# EAGLE schematic PCB_2layers_editada_2607 (EAGLE 9.1.1)
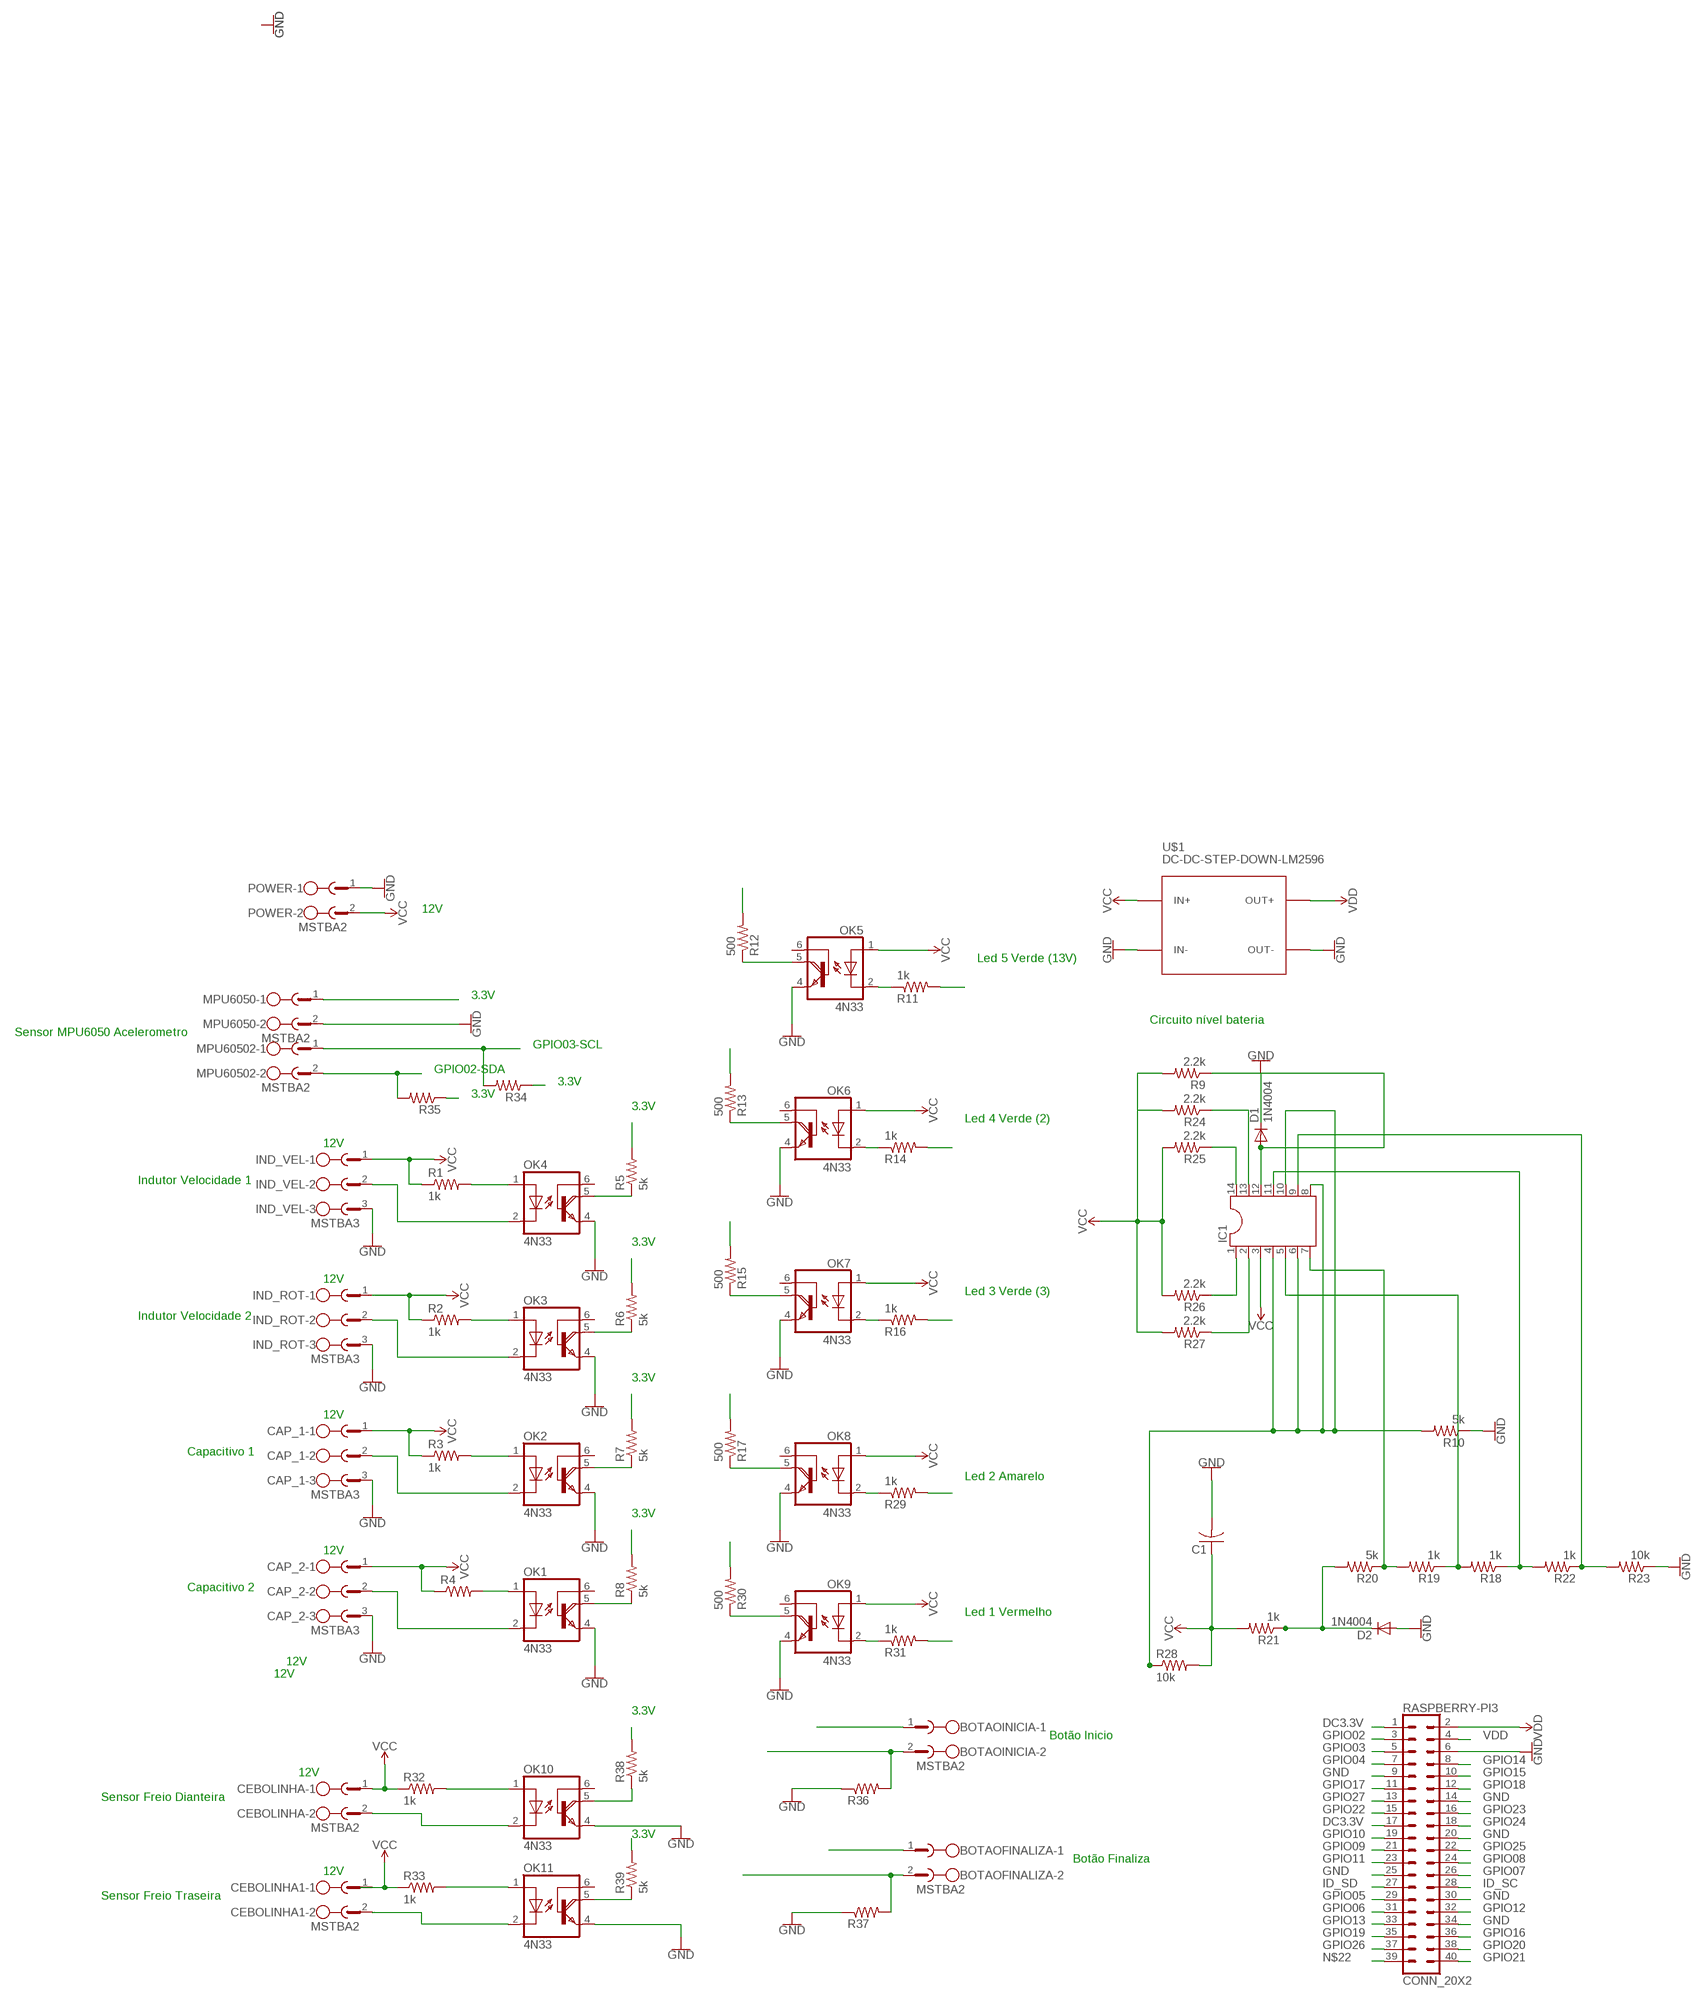
[diagram p0: schematic, sheet 1]

## Parts
BOTAOFINALIZA  MSTBA2  [MSTBA2]
BOTAOINICIA  MSTBA2  [MSTBA2]
C1  C-US025-050X050  [C025-050X050]
CAP_1  MSTBA3  [MSTBA3]
CAP_2  MSTBA3  [MSTBA3]
CEBOLINHA  MSTBA2  [MSTBA2]
CEBOLINHA1  MSTBA2  [MSTBA2]
D1  1N4004  [DO41-10]
D2  1N4004  [DO41-10]
IC1  DIL14  [DIL14]
IND_ROT  MSTBA3  [MSTBA3]
IND_VEL  MSTBA3  [MSTBA3]
MPU6050  MSTBA2  [MSTBA2]
MPU60502  MSTBA2  [MSTBA2]
OK1  4N33  [DIL06]
OK2  4N33  [DIL06]
OK3  4N33  [DIL06]
OK4  4N33  [DIL06]
OK5  4N33  [DIL06]
OK6  4N33  [DIL06]
OK7  4N33  [DIL06]
OK8  4N33  [DIL06]
OK9  4N33  [DIL06]
OK10  4N33  [DIL06]
OK11  4N33  [DIL06]
POWER  MSTBA2  [MSTBA2]
R1  1k  R-US_0204/7  [0204/7]
R2  1k  R-US_0204/7  [0204/7]
R3  1k  R-US_0204/7  [0204/7]
R4  R-US_0204/7  [0204/7]
R5  5k  R-US_0204/7  [0204/7]
R6  5k  R-US_0204/7  [0204/7]
R7  5k  R-US_0204/7  [0204/7]
R8  5k  R-US_0204/7  [0204/7]
R9  2.2k  R-US_0207/10  [0207/10]
R10  5k  R-US_0207/10  [0207/10]
R11  1k  R-US_0204/7  [0204/7]
R12  500  R-US_0204/7  [0204/7]
R13  500  R-US_0204/7  [0204/7]
R14  1k  R-US_0204/7  [0204/7]
R15  500  R-US_0204/7  [0204/7]
R16  1k  R-US_0204/7  [0204/7]
R17  500  R-US_0204/7  [0204/7]
R18  1k  R-US_0207/10  [0207/10]
R19  1k  R-US_0207/10  [0207/10]
R20  5k  R-US_0207/10  [0207/10]
R21  1k  R-US_0207/10  [0207/10]
R22  1k  R-US_0207/10  [0207/10]
R23  10k  R-US_0207/10  [0207/10]
R24  2.2k  R-US_0207/10  [0207/10]
R25  2.2k  R-US_0207/10  [0207/10]
R26  2.2k  R-US_0207/10  [0207/10]
R27  2.2k  R-US_0207/10  [0207/10]
R28  10k  R-US_0207/10  [0207/10]
R29  1k  R-US_0204/7  [0204/7]
R30  500  R-US_0204/7  [0204/7]
R31  1k  R-US_0204/7  [0204/7]
R32  1k  R-US_0204/7  [0204/7]
R33  1k  R-US_0204/7  [0204/7]
R34  R-US_0204/7  [0204/7]
R35  R-US_0204/7  [0204/7]
R36  R-US_0204/7  [0204/7]
R37  R-US_0204/7  [0204/7]
R38  5k  R-US_0204/7  [0204/7]
R39  5k  R-US_0204/7  [0204/7]
RASPBERRY-PI3  CONN_20X2  [2X20]
U$1  DC-DC-STEP-DOWN-LM2596  [DC-DC-STEP-DOWN-LM2596]

## Nets
DC3.3V: BOTAOFINALIZA.1 BOTAOINICIA.1 MPU6050.1 R5.2 R6.2 R7.2 R8.2 R12.2 R13.2 R15.2 R17.2 R30.2 R34.1 R35.1 R38.2 R39.2 RASPBERRY-PI3.1 RASPBERRY-PI3.17
GND: C1.2 CAP_1.3 CAP_2.3 D1.C D2.A IND_ROT.3 IND_VEL.3 MPU6050.2 OK1.4(E) OK2.4(E) OK3.4(E) OK4.4(E) OK5.4(E) OK6.4(E) OK7.4(E) OK8.4(E) OK9.4(E) OK10.4(E) OK11.4(E) POWER.1 R10.1 R23.1 R36.1 R37.1 RASPBERRY-PI3.6 RASPBERRY-PI3.9 RASPBERRY-PI3.14 RASPBERRY-PI3.20 RASPBERRY-PI3.25 RASPBERRY-PI3.30 RASPBERRY-PI3.34 U$1.IN- U$1.OUT-
GPIO01: CEBOLINHA1.2 OK11.2(C)
GPIO02: MPU60502.2 R35.2 RASPBERRY-PI3.3
GPIO03: MPU60502.1 R34.2 RASPBERRY-PI3.5
GPIO04: OK4.5(COL) R5.1 RASPBERRY-PI3.7
GPIO05: RASPBERRY-PI3.29
GPIO06: RASPBERRY-PI3.31
GPIO07: RASPBERRY-PI3.26
GPIO08: RASPBERRY-PI3.24
GPIO09: RASPBERRY-PI3.21
GPIO10: OK1.5(COL) R8.1 RASPBERRY-PI3.19
GPIO11: CEBOLINHA.2 OK10.2(C) RASPBERRY-PI3.23
GPIO12: RASPBERRY-PI3.32
GPIO13: RASPBERRY-PI3.33
GPIO14: OK5.5(COL) R12.1 RASPBERRY-PI3.8
GPIO15: OK6.5(COL) R13.1 RASPBERRY-PI3.10
GPIO16: BOTAOINICIA.2 R36.2 RASPBERRY-PI3.36
GPIO17: OK3.5(COL) R6.1 RASPBERRY-PI3.11
GPIO18: OK7.5(COL) R15.1 RASPBERRY-PI3.12
GPIO19: OK10.5(COL) R38.1 RASPBERRY-PI3.35
GPIO20: BOTAOFINALIZA.2 R37.2 RASPBERRY-PI3.38
GPIO21: RASPBERRY-PI3.40
GPIO22: OK2.5(COL) R7.1 RASPBERRY-PI3.15
GPIO23: OK8.5(COL) R17.1 RASPBERRY-PI3.16
GPIO24: OK9.5(COL) R30.1 RASPBERRY-PI3.18
GPIO25: RASPBERRY-PI3.22
GPIO26: OK11.5(COL) R39.1 RASPBERRY-PI3.37
GPIO27: RASPBERRY-PI3.13
ID_SC: RASPBERRY-PI3.28
ID_SD: RASPBERRY-PI3.27
LM339P1: IC1.1 R11.2 R26.1
LM339P2: IC1.2 R14.2 R27.1
LM339P12: R31.2
LM339P13: IC1.13 R16.2 R24.1
LM339P14: IC1.14 R25.1 R29.2
LM33912: D1.A IC1.12 R9.1
N$1: IND_ROT.2 OK3.2(C)
N$2: CAP_2.2 OK1.2(C)
N$3: CAP_1.2 OK2.2(C)
N$4: OK3.1(A) R2.2
N$5: OK2.1(A) R3.2
N$6: OK1.1(A) R4.2
N$7: OK4.1(A) R1.2
N$8: IND_VEL.2 OK4.2(C)
N$13: D2.C R20.2 R21.1
N$14: IC1.9 R22.1 R23.2
N$15: IC1.4 IC1.6 IC1.8 IC1.10 R10.2 R28.1
N$16: IC1.5 R18.2 R19.1
N$17: IC1.11 R18.1 R22.2
N$18: IC1.7 R19.2 R20.1
N$22: RASPBERRY-PI3.39
N$24: OK5.2(C) R11.1
N$27: OK6.2(C) R14.1
N$28: OK10.1(A) R32.2
N$29: OK7.2(C) R16.1
N$31: OK8.2(C) R29.1
N$33: OK9.2(C) R31.1
N$34: OK11.1(A) R33.2
VCC: C1.1 CAP_1.1 CAP_2.1 CEBOLINHA1.1 CEBOLINHA.1 IC1.3 IND_ROT.1 IND_VEL.1 OK5.1(A) OK6.1(A) OK7.1(A) OK8.1(A) OK9.1(A) POWER.2 R1.1 R2.1 R3.1 R4.1 R9.2 R21.2 R24.2 R25.2 R26.2 R27.2 R28.2 R32.1 R33.1 U$1.IN+
VDD: RASPBERRY-PI3.2 RASPBERRY-PI3.4 U$1.OUT+
Unconnected: OK1.6(B) OK2.6(B) OK3.6(B) OK4.6(B) OK5.6(B) OK6.6(B) OK7.6(B) OK8.6(B) OK9.6(B) OK10.6(B) OK11.6(B)

## Notes on the sheet
- 12V
- Led 5 Verde (13V)
- 3.3V
- Circuito nível bateria
- Sensor MPU6050 Acelerometro
- GPIO03-SCL
- GPIO02-SDA
- 3.3V
- 3.3V
- 3.3V
- Led 4 Verde (2)
- 12V
- Indutor Velocidade 1
- 3.3V
- 12V
- Led 3 Verde (3)
- Indutor Velocidade 2
- 3.3V
- 12V
- Capacitivo 1
- Led 2 Amarelo
- 3.3V
- 12V
- Capacitivo 2
- Led 1 Vermelho
- 12V
- 12V
- 3.3V
- Botão Inicio
- 12V
- Sensor Freio Dianteira
- 3.3V
- Botão Finaliza
- 12V
- Sensor Freio Traseira

## Library data of the parts
BOTAOFINALIZA BOTAOINICIA CEBOLINHA CEBOLINHA1 MPU6050 MPU60502 POWER = con-phoenix-508:MSTBA2: PHOENIX; MF: FARNELL; MPN: 1757242; OC_FARNELL: 3705171; OC_NEWARK: 71C4161
C1 = adafruit:C-US: CAPACITOR, American symbol
CAP_1 CAP_2 IND_ROT IND_VEL = con-phoenix-508:MSTBA3: PHOENIX; MF: FARNELL; MPN: 1757255; OC_FARNELL: 3705183; OC_NEWARK: 71C4162
D1 D2 = adafruit:1N4004: DIODE General purpose 1N400x type rectifier (With bigger pads) http://www.ladyada.net/library/pcb/eaglelibrary.html
IC1 = ic-package:DIL14: Dual In Line / Socket
OK1-OK11 = optocoupler:4N33: MOTOROLA OPTO COUPLER; MF: VISHAY/TELEFUNKEN; MPN: 4N33; OC_FARNELL: 1469601; OC_NEWARK: 88K1390
R1-R8 R11-R17 R29-R39 = rcl:R-US_: RESISTOR, American symbol
R9 R10 R18-R28 = adafruit:R-US_: RESISTOR, American symbol
RASPBERRY-PI3 = SparkFun-Connectors:CONN_20X2: Multi connection point. Often used as Generic Header-pin footprint for 0.1 inch spaced/style header connections On any of the 0.1 inch spaced packages, you can populate with these: Break Away Headers - Straight <https://www.sparkfun.com/products/116> (PRT-00116) Break Away Male Headers - Right Angle <https://www.sparkfun.com/products/553> (PRT-00553) Female Headers <https://www.sparkfun.com/products/115> (PRT-00115) Break Away Headers - Machine Pin <https://www.sparkfun.com/products/117> (PRT-00117) Break Away Female Headers - Swiss Machine Pin <https://www.sparkfun.com/products/743> (PRT-00743)
U$1 = diy-modules:DC-DC-STEP-DOWN-LM2596: DC/DC Step-Down Regulator based on LM2596-ADJ chip LM2596 datasheet available here: http://www.ti.com/lit/ds/symlink/lm2596.pdf Click here to find device on ebay.com <http://www.ebay.com/sch/lm2596+power+regulator>

## Net classes
0 default: width 0.813 mm, drill 0.813 mm, clearance 0.152 mm
1 pwr: width 0.813 mm, clearance 0.254 mm